# EAGLE design saw-dcc6e-breakout (EAGLE 5.11)
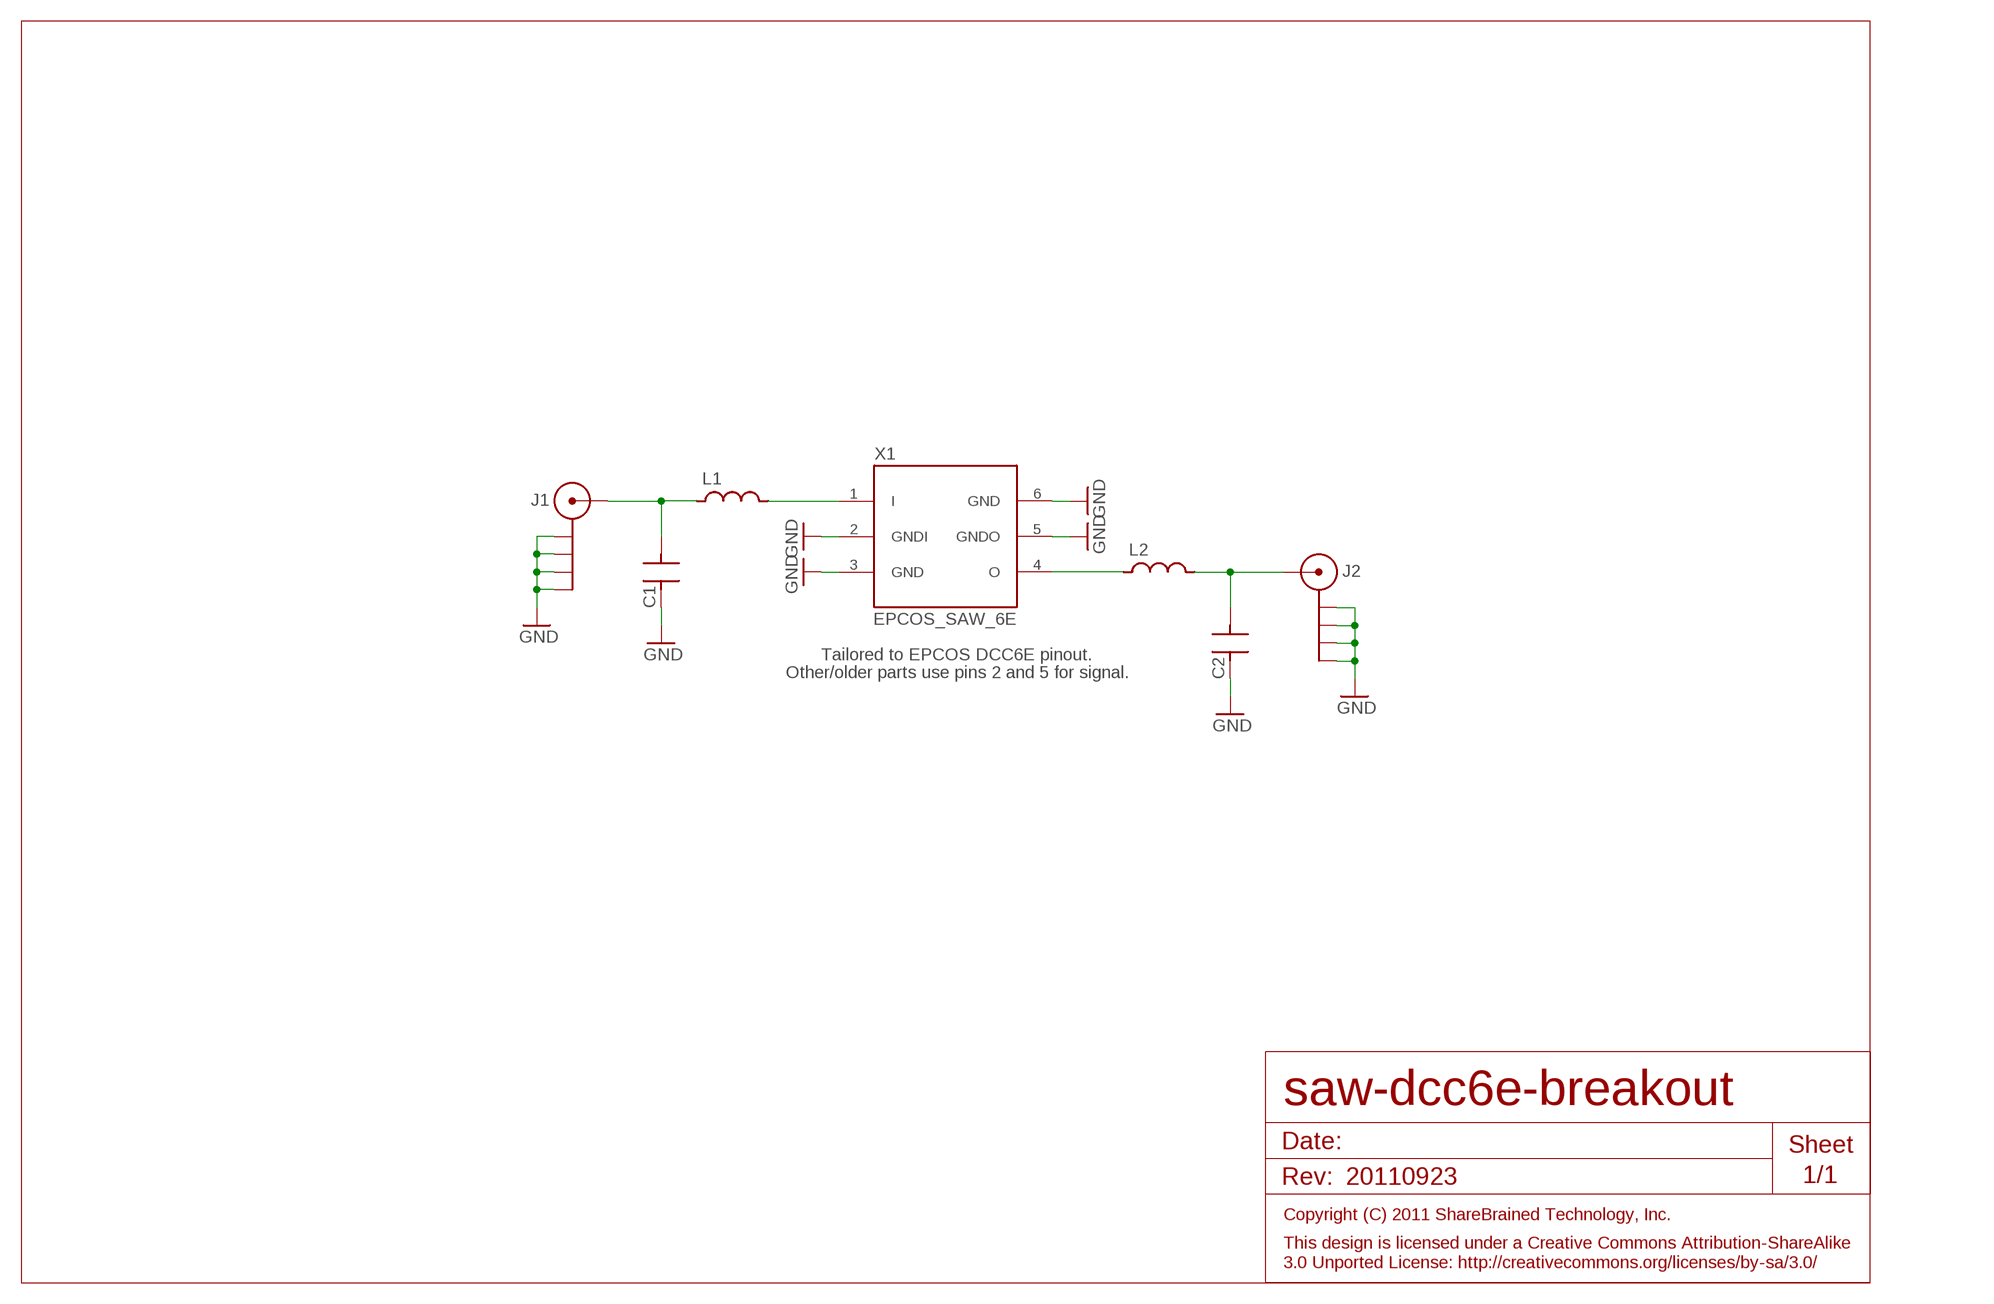
[diagram p0: schematic, sheet 1]

## Parts
C1  C0402_55  [CAPC1005X55N]
C2  C0402_55  [CAPC1005X55N]
J1  SMA142-0701-801  [142-0701-801]
J2  SMA142-0701-801  [142-0701-801]
L1  L0603_95  [INDC1608X95N]
L2  L0603_95  [INDC1608X95N]
X1  EPCOS_SAW_6E  [EPCOS_DCC6_X]

## Nets
GND: C1.1 C2.1 J1.RING@1(RING) J1.RING@2(RING) J1.RING@3(RING) J1.RING@4(RING) J2.RING@1(RING) J2.RING@2(RING) J2.RING@3(RING) J2.RING@4(RING) X1.2(GNDI) X1.3(GND) X1.5(GNDO) X1.6(GND)
N$1: L2.1 X1.4(O)
N$2: L1.2 X1.1(I)
N$3: C1.2 J1.TIP L1.1
N$4: C2.2 J2.TIP L2.2

## Notes on the sheet
- Tailored to EPCOS DCC6E pinout.
- Other/older parts use pins 2 and 5 for signal.
- 20110923

## Library data of the parts
C1 C2 = capacitor:C
J1 J2 = sma:SMA
L1 L2 = inductor:L
X1 = filter:EPCOS_SAW_6E

## Board
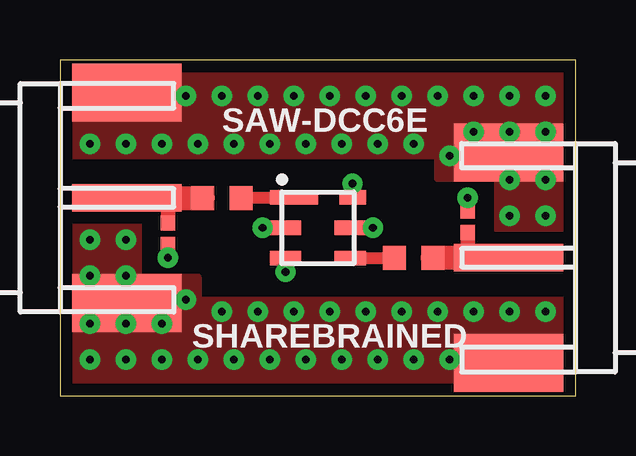
[diagram p1: board, top side]
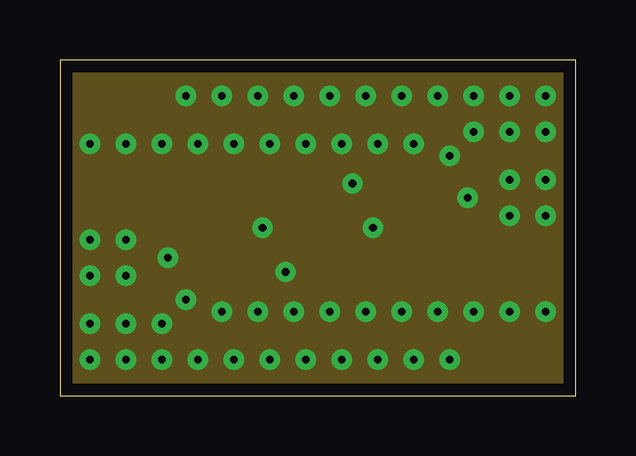
[diagram p2: board, inner layer Route2]
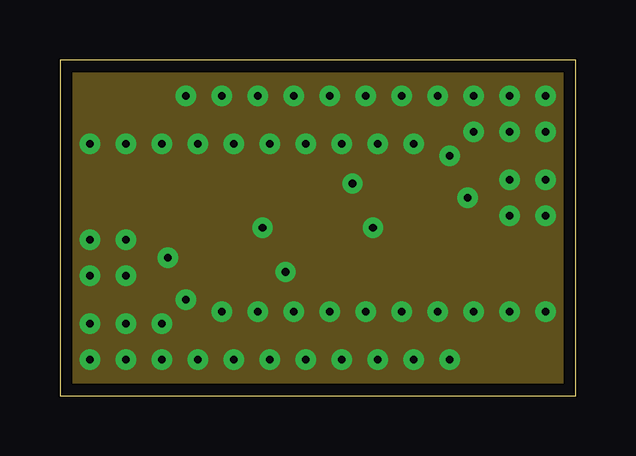
[diagram p3: board, inner layer Route15]
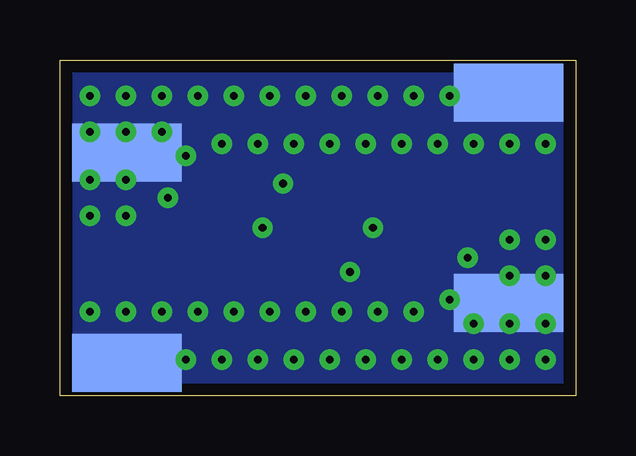
[diagram p4: board, bottom side, seen from below]

Size 21.5 x 14 mm. Coordinates in mm from the lower left corner, seen from the top.
Outline: 0,0 21.5,0 21.5,14 0,14 0,0
Copper layers (1+2*15+16): Top 0.0178mm / dielectric 0.3048mm / Route2 0.0356mm / dielectric 0.7112mm / Route15 0.0356mm / dielectric 0.3048mm / Bottom 0.0178mm
Design rules "saw-dcc6e-breakout": minimum track width 0.3mm, minimum drill 13mil, track to track 0.2mm, track to pad 0.2mm, pad to pad 0.2mm, via to via 0.2mm, smd to smd 0.2mm, copper to edge 20mil, drill to drill 16mil, minimum pad ring 10mil, minimum via ring 10mil, stop-mask expansion 3mil, vias tented up to drill 13mil, thermal gap 8mil

### Footprints (pad centres in the part's own frame; a part is rotated, then mirrored left to right if it is on the bottom)
CAPC1005X55N = smd 0.62 x 0.62: 1 -0.45,0; 2 0.45,0
142-0701-801 = smd 2.413 x 4.572: RING@1 -4.381,-2.794; RING@2 4.381,-2.794 | smd 2.413 x 4.572 bottom: RING@3 -4.381,-2.794; RING@4 4.381,-2.794 | smd 1.143 x 4.572: TIP 0,-2.794
INDC1608X95N = smd 0.95 x 1: 1 -0.8,0; 2 0.8,0
EPCOS_DCC6_X = smd 2 x 0.6: 1 -1,1.27 | smd 1.3 x 0.6: 2 -1.35,0; 3 -1.35,-1.27; 4 1.35,-1.27; 5 1.35,0 | smd 1.1 x 0.6: 6 1.45,1.27

### Placement (x,y rotation side)
C1  4.5,6.75 90 top
C2  17,7.25 270 top
J1  0,8.25 90 top
J2  21.5,5.75 270 top
L1  6.75,8.25 0 top
L2  14.75,5.75 0 top
X1  10.75,7 0 top

### Tracks (layer width: path | path; a pad name or v marks a point on that pad's centre or on a via)
GND  (via drill 0.33)
  Top 0.5: X1.3 v9.4,5.15 | X1.6 v12.2,8.85 | X1.2 v8.45,7 | X1.5 v13.05,7
  Top 0.6: C1.1 v4.5,5.75 | C2.1 v17,8.25
  other vias: 5.25,12.5 1.25,10.5 2.75,10.5 4.25,10.5 5.75,10.5 7.25,10.5 16.25,10 14.75,10.5 6.75,12.5 8.75,10.5 10.25,10.5 11.75,10.5 13.25,10.5 18.75,7.5 2.75,6.5 1.25,3 2.75,3 1.25,6.5 20.25,3.5 17.25,3.5 15.75,3.5 8.25,3.5 9.75,3.5 6.75,3.5 5.25,4 11.25,3.5 12.75,3.5 14.25,3.5 18.75,3.5 4.25,3 2.75,5 1.25,5 1.25,1.5 2.75,1.5 4.25,1.5 5.75,1.5 7.25,1.5 8.75,1.5 10.25,1.5 11.75,1.5 13.25,1.5 14.75,1.5 16.25,1.5 17.25,11 18.75,11 20.25,11 20.25,7.5 20.25,9 18.75,9 8.25,12.5 9.75,12.5 11.25,12.5 12.75,12.5 14.25,12.5 15.75,12.5 17.25,12.5 18.75,12.5 20.25,12.5
  pour Route2 (no thermals): 0,0 0,14 21.5,14 21.5,0
  pour Route15 (no thermals): 0,0 0,14 21.5,14 21.5,0
  pour Top (isolate 0.5, no thermals): 0,10 0,14 21.5,14 21.5,5.75 18.25,5.75 18.25,9.05 15.75,9.05 15.75,10
  pour Top (isolate 0.5, no thermals): 0,0 0,8.25 3.25,8.25 3.25,4.95 5.75,4.95 5.75,4 21.5,4 21.5,0
  pour Bottom (no thermals): 0,0 0,14 21.5,14 21.5,0
N$1
  Top 0.5: L2.1 13.93,5.73 X1.4
N$2
  Top 0.5: L1.2 7.57,8.27 X1.1
N$3
  Top 0.6: C1.2 4.5,8.25
  Top 1: J1.TIP 4.5,8.25 L1.1
N$4
  Top 0.6: C2.2 17,5.75
  Top 1: L2.2 17,5.75 J2.TIP

### Text on the board
tPlace: SAW-DCC6E | SHAREBRAINED